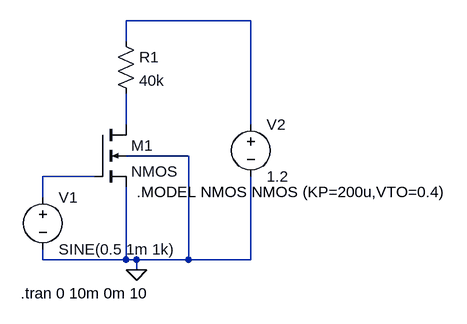
[diagram p0: schematic common_source NMOS amplifier.asc]
common_source NMOS amplifier.asc, the LTspice schematic file:
Version 4
SHEET 1 880 680
WIRE 368 -48 176 -48
WIRE 176 -16 176 -48
WIRE 176 112 176 64
WIRE 368 112 368 -48
WIRE 272 160 176 160
WIRE 128 192 48 192
WIRE 48 224 48 192
WIRE 48 320 48 304
WIRE 176 320 176 208
WIRE 176 320 48 320
WIRE 192 320 176 320
WIRE 272 320 272 160
WIRE 272 320 192 320
WIRE 368 320 368 192
WIRE 368 320 272 320
WIRE 192 336 192 320
FLAG 192 336 0
SYMBOL nmos4 128 112 R0
SYMATTR InstName M1
SYMATTR Value2 l=1u w=10u
SYMBOL voltage 48 208 R0
WINDOW 123 0 0 Left 0
WINDOW 39 0 0 Left 0
SYMATTR InstName V1
SYMATTR Value SINE(0.5 1m 1k)
SYMBOL res 160 -32 R0
SYMATTR InstName R1
SYMATTR Value 40k
SYMBOL voltage 368 96 R0
SYMATTR InstName V2
SYMATTR Value 1.2
TEXT 192 216 Left 2 !.MODEL NMOS NMOS (KP=200u,VTO=0.4)
TEXT 14 372 Left 2 !.tran 0 10m 0m 10

The netlist it stands for:
* common_source NMOS amplifier.asc
M1 N002 N003 0 0 NMOS l=1u w=10u
V1 N003 0 SINE(0.5 1m 1k)
R1 N001 N002 40k
V2 N001 0 1.2
.model NMOS NMOS
.model PMOS PMOS
.lib standard.mos
.MODEL NMOS NMOS (KP=200u,VTO=0.4)
.tran 0 10m 0m 10
.backanno
.end